# Altium project 家庭版电针仪.PrjPCB
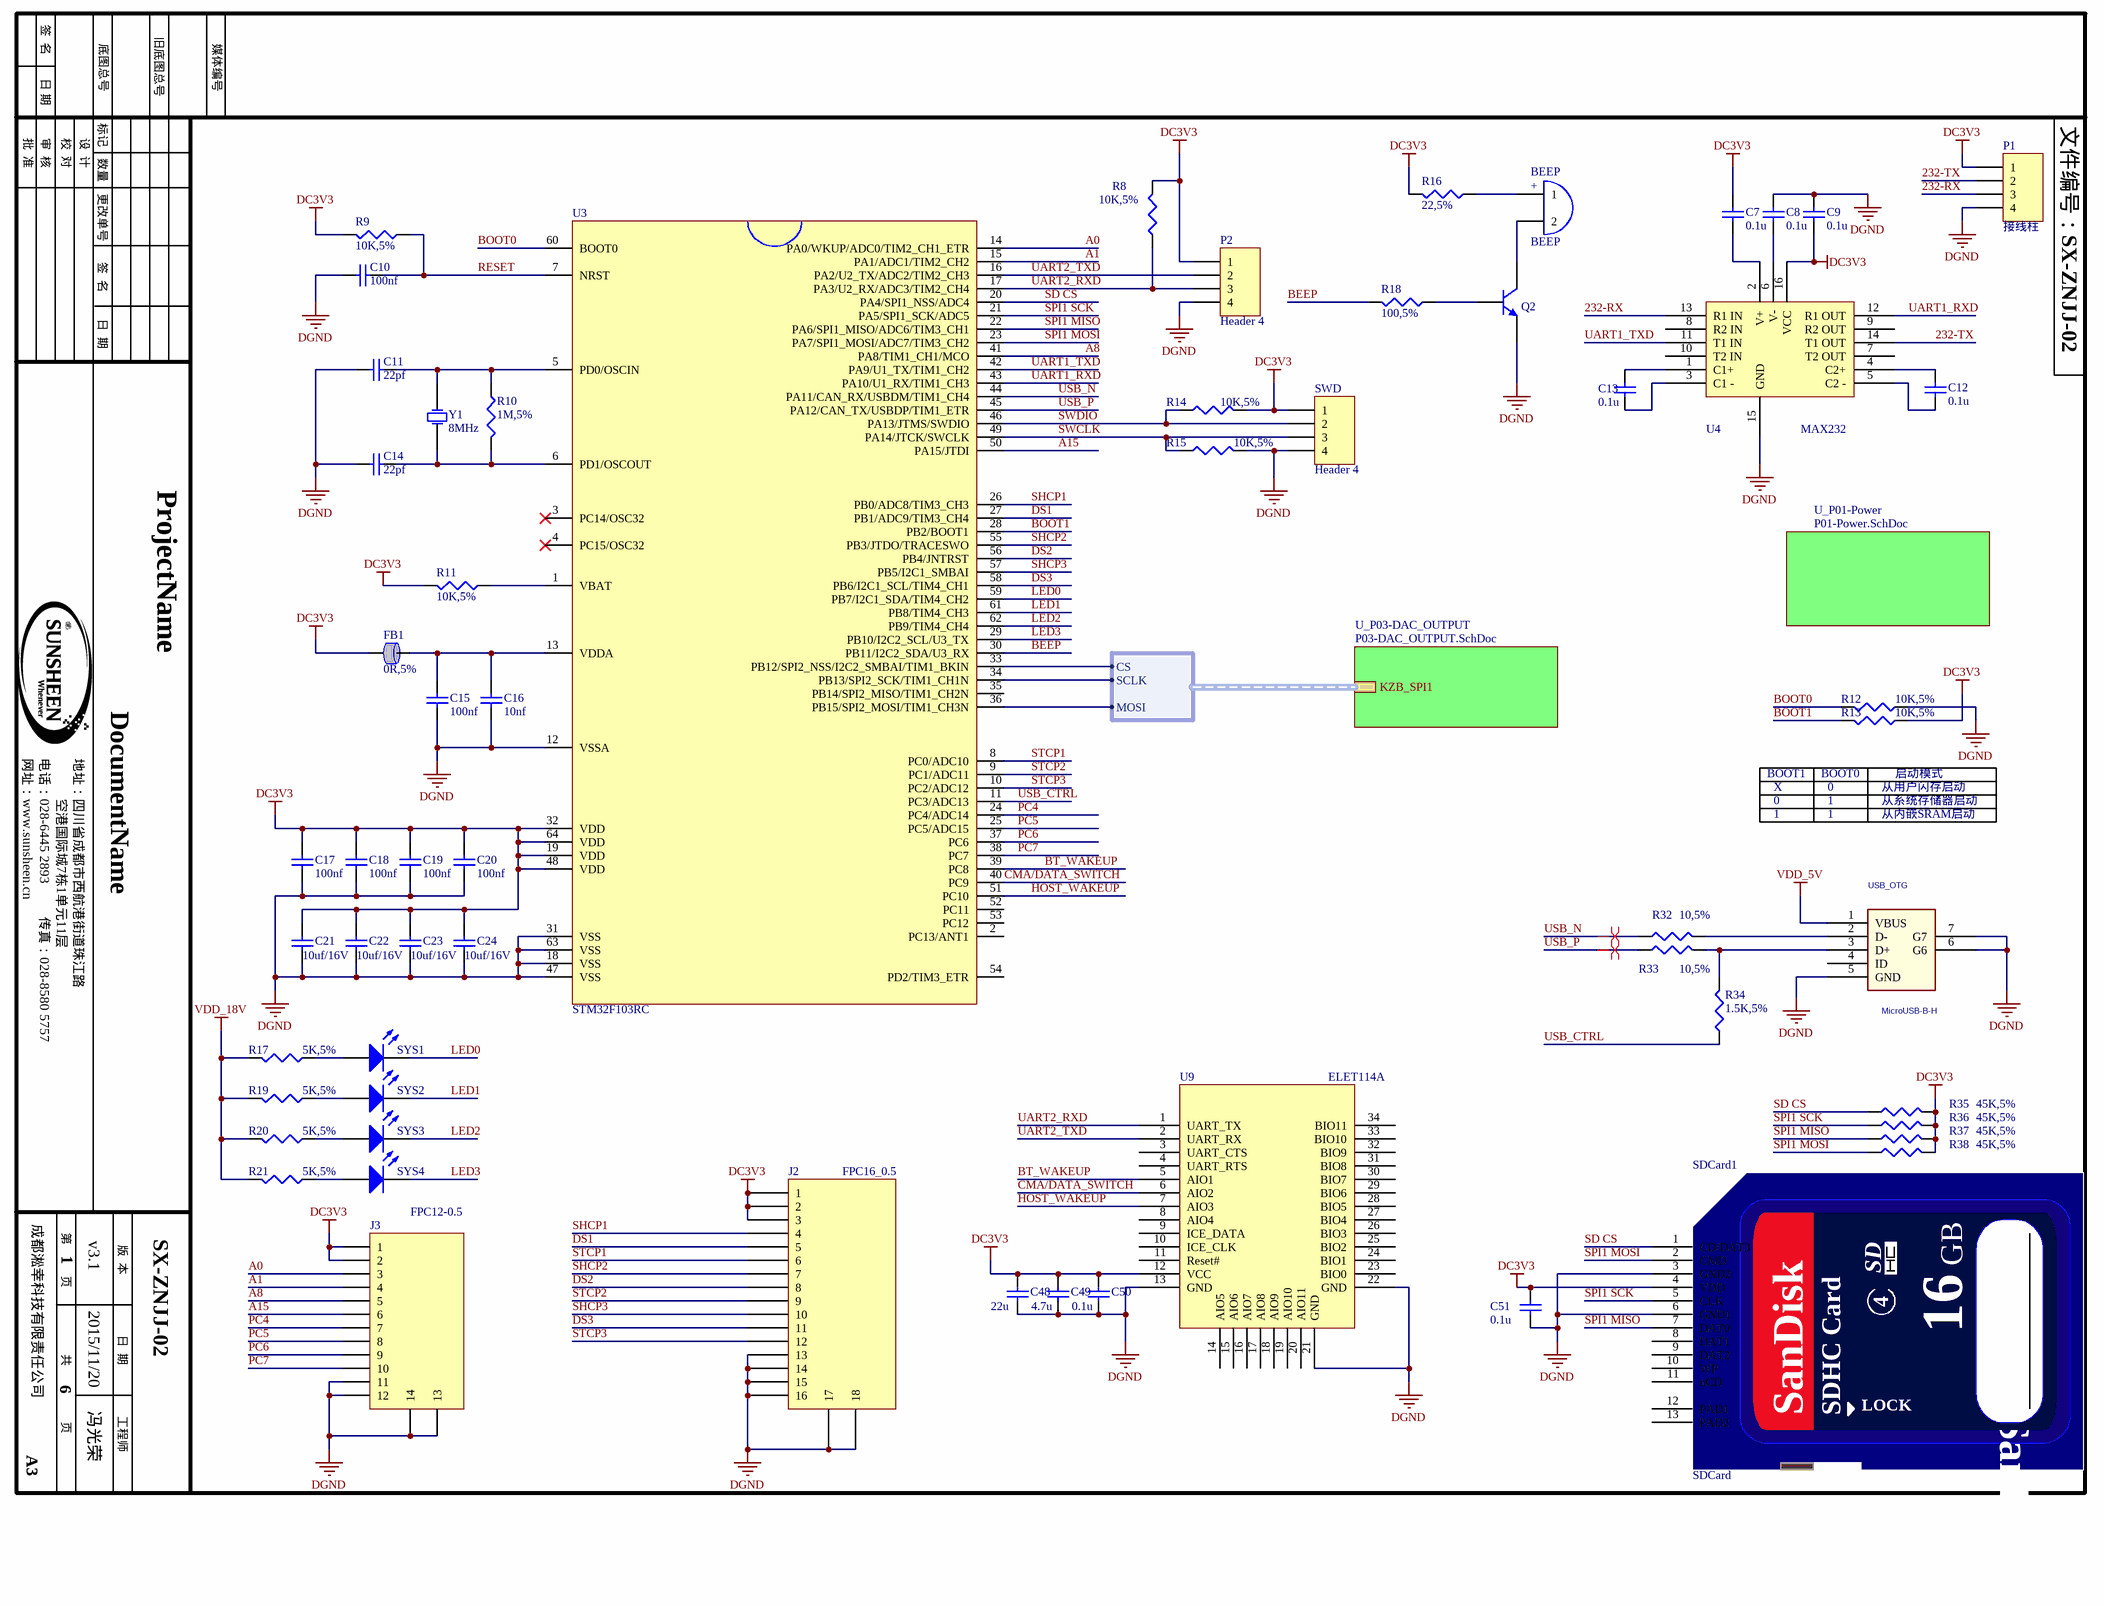
[diagram p0: MCU.SchDoc]
4 sheets, 197 parts. Net scope: hierarchical (ports join the sheet entries above them; power ports are global).
Board file: 家庭版电针仪.PcbDoc
Sheets:
  MCU.SchDoc
    U_P03-DAC_OUTPUT = P03-DAC_OUTPUT.SchDoc
      DAC1 = DAC_OUT.SchDoc
      DAC2 = DAC_OUT.SchDoc
      DAC3 = DAC_OUT.SchDoc
      DAC4 = DAC_OUT.SchDoc
    U_P01-Power = P01-Power.SchDoc

## Sheet MCU.SchDoc
size A3; Date: 2015/11/20; CompanyName: 成都淞幸科技有限责任公司; DrawnBy: 冯光荣; Engineer: 冯光荣; Organization: 系统集成部; Address1: 四川省成都市西航港街道珠江路; Address2: 空港国际城7栋1单元11层; DocumentNumber: SX-ZNJJ-02; Revision: v3.1; SheetNumber: 1; SheetTotal: 6; Telphone: 028-6445 2893; Fax: 028-8580 5757; Website: www.sunsheen.cn; DocumentName: DocumentName; ProjectName: ProjectName

### Parts
BEEP  BEEP  [蜂鸣器]
C7  0.1u  [Cap0603]
C8  0.1u  [Cap0603]
C9  0.1u  [Cap0603]
C10  100nf  [Cap0603]
C11  22pf  [Cap0603]
C12  0.1u  [Cap0603]
C13  0.1u  [Cap0603]
C14  22pf  [Cap0603]
C15  100nf  [Cap0603]
C16  10nf  [Cap0603]
C17  100nf  [Cap0603]
C18  100nf  [Cap0603]
C19  100nf  [Cap0603]
C20  100nf  [Cap0603]
C21  10uf/16V  [Cap0603]
C22  10uf/16V  [Cap0603]
C23  10uf/16V  [Cap0603]
C24  10uf/16V  [Cap0603]
C48  22u  [Cap0603]
C49  4.7u  [Cap0603]
C50  0.1u  [Cap0603]
C51  0.1u  [Cap0603]
FB1  0R,5%  [FB0603]
J2  FPC16_0.5  [FPC0.5-16P]
J3  FPC12-0.5  [FPC0.5-12P]
P1  接线柱  [4P接线柱5.08mm]
P2  Header 4  [HDR1X4]
Q2  S8050  [SOT-23B]  (value not drawn)
R8  10K,5%  [Res0603]
R9  10K,5%  [Res0603]
R10  1M,5%  [Res0603]
R11  10K,5%  [Res0603]
R12  10K,5%  [Res0603]
R13  10K,5%  [Res0603]
R14  10K,5%  [Res0603]
R15  10K,5%  [Res0603]
R16  22,5%  [Res0603]
R17  5K,5%  [Res0603]
R18  100,5%  [Res0603]
R19  5K,5%  [Res0603]
R20  5K,5%  [Res0603]
R21  5K,5%  [Res0603]
R32  10,5%  [Res0603]
R33  10,5%  [Res0603]
R34  1.5K,5%  [Res0603]
R35  45K,5%  [Res0603]
R36  45K,5%  [Res0603]
R37  45K,5%  [Res0603]
R38  45K,5%  [Res0603]
SDCard1  SDCard  [SDCard]
SWD  Header 4  [HDR1X4]
SYS1  RED  [坐式LED]  (value not drawn)
SYS2  RED  [坐式LED]  (value not drawn)
SYS3  RED  [坐式LED]  (value not drawn)
SYS4  RED  [坐式LED]  (value not drawn)
U3  STM32F103RC  [QFP50P1200X1200X160-64N]
U4  MAX232  [SO-16]
U9  ELET114A  [ELET114A]
USB_OTG  MicroUSB-B-H  [MICROUSB-B-H]
Y1  8MHz  [XTAL_49SMD]

### Sub-sheets
U_P01-Power = P01-Power.SchDoc: no entries
U_P03-DAC_OUTPUT = P03-DAC_OUTPUT.SchDoc: KZB_SPI1 (harness KZB_SPI1)

### Harnesses
KZB_SPI1: CS, SCLK, MOSI

### Nets
DC3V3: C7.2 C9.1 C17.2 C18.2 C19.2 C20.2 C21.2 C22.2 C23.2 C24.2 C48.2 C49.2 C50.2 C51.1 FB1.1 J2.1 J2.2 J2.3 J3.1 J3.2 P1.1 P2.1 R8.2 R9.2 R11.2 R13.1 R14.2 R16.2 R35.2 R36.2 R37.2 R38.2 SDCard1.4(VDD) SWD.1 U3.19(VDD) U3.32(VDD) U3.48(VDD) U3.64(VDD) U4.16(VCC) U9.12(VCC)
DGND: C8.2 C9.2 C10.1 C11.1 C14.1 C15.1 C16.1 C17.1 C18.1 C19.1 C20.1 C21.1 C22.1 C23.1 C24.1 C48.1 C49.1 C50.1 C51.2 J2.13 J2.14 J2.15 J2.16 J2.17 J2.18 J3.11 J3.12 J3.13 J3.14 P1.4 P2.4 Q2.2(E) R12.1 R15.2 SDCard1.3(GND2) SDCard1.6(GND1) SWD.4 U3.12(VSSA) U3.18(VSS) U3.31(VSS) U3.47(VSS) U3.63(VSS) U4.15(GND) U9.13(GND) U9.21(GND) U9.22(GND) USB_OTG.5(GND) USB_OTG.6(G6) USB_OTG.7(G7)
VDD_5V: USB_OTG.1(VBUS)
VDD_18V: R17.1 R19.1 R20.1 R21.1
232-RX: P1.3 U4.13(R1_IN)
232-TX: P1.2 U4.14(T1_OUT)
A0: J3.3 U3.14(PA0/WKUP/ADC0/TIM2_CH1_ETR)
A1: J3.4 U3.15(PA1/ADC1/TIM2_CH2)
A8: J3.5 U3.41(PA8/TIM1_CH1/MCO)
A15: J3.6 U3.50(PA15/JTDI)
BEEP: R18.2 U3.30(PB11/I2C2_SDA/U3_RX)
BOOT0: R12.2 U3.60(BOOT0)
BOOT1: R13.2 U3.28(PB2/BOOT1)
BT_WAKEUP: U3.39(PC8) U9.5(AIO1)
CMA/DATA_SWITCH: U3.40(PC9) U9.6(AIO2)
DS1: J2.5 U3.27(PB1/ADC9/TIM3_CH4)
DS2: J2.8 U3.56(PB4/JNTRST)
DS3: J2.11 U3.58(PB6/I2C1_SCL/TIM4_CH1)
HOST_WAKEUP: U3.51(PC10) U9.7(AIO3)
LED0: SYS1.K U3.59(PB7/I2C1_SDA/TIM4_CH2)
LED1: SYS2.K U3.61(PB8/TIM4_CH3)
LED2: SYS3.K U3.62(PB9/TIM4_CH4)
LED3: SYS4.K U3.29(PB10/I2C2_SCL/U3_TX)
PC4: J3.7 U3.24(PC4/ADC14)
PC5: J3.8 U3.25(PC5/ADC15)
PC6: J3.9 U3.37(PC6)
PC7: J3.10 U3.38(PC7)
RESET: C10.2 R9.1 U3.7(NRST)
SD CS: R35.1 SDCard1.1(CD/DAT3) U3.20(PA4/SPI1_NSS/ADC4)
SHCP1: J2.4 U3.26(PB0/ADC8/TIM3_CH3)
SHCP2: J2.7 U3.55(PB3/JTDO/TRACESWO)
SHCP3: J2.10 U3.57(PB5/I2C1_SMBAI)
SPI1 MISO: R37.1 SDCard1.7(DAT0) U3.22(PA6/SPI1_MISO/ADC6/TIM3_CH1)
SPI1 MOSI: R38.1 SDCard1.2(CMD) U3.23(PA7/SPI1_MOSI/ADC7/TIM3_CH2)
SPI1 SCK: R36.1 SDCard1.5(CLK) U3.21(PA5/SPI1_SCK/ADC5)
STCP1: J2.6 U3.8(PC0/ADC10)
STCP2: J2.9 U3.9(PC1/ADC11)
STCP3: J2.12 U3.10(PC2/ADC12)
SWCLK: R15.1 SWD.3 U3.49(PA14/JTCK/SWCLK)
SWDIO: R14.1 SWD.2 U3.46(PA13/JTMS/SWDIO)
UART1_RXD: U3.43(PA10/U1_RX/TIM1_CH3) U4.12(R1_OUT)
UART1_TXD: U3.42(PA9/U1_TX/TIM1_CH2) U4.11(T1_IN)
UART2_RXD: P2.3 R8.1 U3.17(PA3/U2_RX/ADC3/TIM2_CH4) U9.1(UART_TX)
UART2_TXD: P2.2 U3.16(PA2/U2_TX/ADC2/TIM2_CH3) U9.2(UART_RX)
USB_CTRL: R34.1 U3.11(PC3/ADC13)
USB_N: R32.1 U3.44(PA11/CAN_RX/USBDM/TIM1_CH4)
USB_P: R33.1 U3.45(PA12/CAN_TX/USBDP/TIM1_ETR)
NetBEEP_1: BEEP.1 R16.1
NetBEEP_2: BEEP.2 Q2.3(C)
NetC7_1: C7.1 U4.2(V+)
NetC8_1: C8.1 U4.6(V-)
NetC11_2: C11.2 R10.1 U3.5(PD0/OSCIN) Y1.1(OSC1)
NetC12_1: C12.1 U4.5(C2_-)
NetC12_2: C12.2 U4.4(C2+)
NetC13_1: C13.1 U4.3(C1_-)
NetC13_2: C13.2 U4.1(C1+)
NetC14_2: C14.2 R10.2 U3.6(PD1/OSCOUT) Y1.2(OSC2)
NetC15_2: C15.2 C16.2 FB1.2 U3.13(VDDA)
NetQ2_1: Q2.1(B) R18.1
NetR11_1: R11.1 U3.1(VBAT)
NetR17_2: R17.2 SYS1.A
NetR19_2: R19.2 SYS2.A
NetR20_2: R20.2 SYS3.A
NetR21_2: R21.2 SYS4.A
NetR32_2: R32.2 USB_OTG.2(D-)
NetR33_2: R33.2 R34.2 USB_OTG.3(D+)
NetU3_33: U3.33(PB12/SPI2_NSS/I2C2_SMBAI/TIM1_BKIN) ; sheet U_P03-DAC_OUTPUT/KZB_SPI1.CS
NetU3_34: U3.34(PB13/SPI2_SCK/TIM1_CH1N) ; sheet U_P03-DAC_OUTPUT/KZB_SPI1.SCLK
NetU3_36: U3.36(PB15/SPI2_MOSI/TIM1_CH3N) ; sheet U_P03-DAC_OUTPUT/KZB_SPI1.MOSI

Not connected (* = marked no-connect by the designer): SDCard1 8(DAT1) 9(DAT2) 10(WP) 11(nCD) 12(PAD1) 13(PAD2); U3 2(PC13/ANT1) 3(PC14/OSC32)* 4(PC15/OSC32)* 35(PB14/SPI2_MISO/TIM1_CH2N) 52(PC11) 53(PC12) 54(PD2/TIM3_ETR); U4 7(T2_OUT) 8(R2_IN) 9(R2_OUT) 10(T2_IN); U9 3(UART_CTS) 4(UART_RTS) 8(AIO4) 9(ICE_DATA) 10(ICE_CLK) 11(Reset#) 14(AIO5) 15(AIO6) 16(AIO7) 17(AIO8) 18(AIO9) 19(AIO10) 20(AIO11) 23(BIO0) 24(BIO1) 25(BIO2) 26(BIO3) 27(BIO4) 28(BIO5) 29(BIO6) 30(BIO7) 31(BIO8) 32(BIO9) 33(BIO10) 34(BIO11); USB_OTG 4(ID)

### Layout directives
differential pair: USB_N, USB_P

### Notes on the sheet
- BOOT1
- BOOT0
- 启动模式
- X
- 0
- 1
- 从用户闪存启动
- 从系统存储器启动
- 从内嵌SRAM启动
- 签  名
- 底图总号
- 旧底图总号
- 媒体编号
- 日 期
- 批  准
- 审  核
- 校  对
- 设  计
- 标记
- 数量
- 文件编号：
- 更改单号
- 日  期
- 网址：
- 电话：
- 地址：
- 传真：
- 第
- 版  本
- 页
- 共
- A3
- 工程师
- (in symbol BELL) +
- (in symbol SDCard) GB; SD; 16; SanDisk; SDHC Card; LOCK

### Library data of the parts
BEEP = BELL
C7-C24 C48-C51 = Cap Semi: 无极性电容（表贴）
FB1 = FerriteBead: 磁珠
P1 P2 SWD = Header 4: Header, 4-Pin
  SWD: LatestRevisionDate: 17-Jul-2002; LatestRevisionNote: Re-released for DXP Platform.; Publisher: Altium Limited
Q2 = S8050: NPN
R8-R21 R32-R38 = Res: 电阻
SDCard1 = SDCard: SDCard插座
SYS1-SYS4 = LED: Typical RED, GREEN, YELLOW, AMBER GaAs LED
U4 = MAX232AEWE(16): +-15KV ESD-PROTECTED, +5V RS-232 TRANSCEIVERS
USB_OTG = MicroUSB-B-H: 手机接口型USB
Y1 = XTAL: 晶体振荡器

## Sheet P03-DAC_OUTPUT.SchDoc
size A3; Date: 2015/11/20; CompanyName: 成都淞幸科技有限责任公司; DrawnBy: 冯光荣; Engineer: 冯光荣; Organization: 系统集成部; Address1: 四川省成都市西航港街道珠江路; Address2: 空港国际城7栋1单元11层; DocumentNumber: SX-ZNJJ-02; Revision: v3.1; SheetNumber: 4; SheetTotal: 6; Telphone: 028-6445 2893; Fax: 028-8580 5757; Website: www.sunsheen.cn; DocumentName: DocumentName; ProjectName: ProjectName
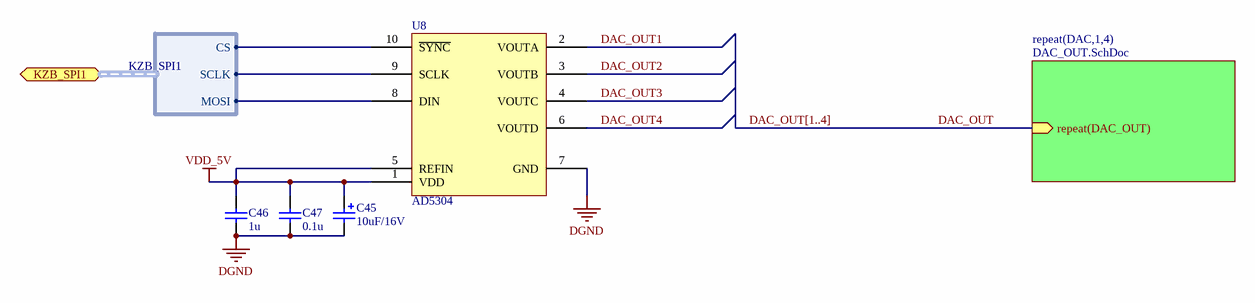
[diagram p1: P03-DAC_OUTPUT.SchDoc]

### Parts
C45  10uF/16V  [CAPPLO3_A_3216-18]
C46  1u  [Cap0603]
C47  0.1u  [Cap0603]
U8  AD5304  [MSOP10]

### Sub-sheets
repeat(DAC,1,4) = DAC_OUT.SchDoc: repeat(DAC_OUT) (in)

### Ports
KZB_SPI1 (harness KZB_SPI1)

### Harnesses
KZB_SPI1: CS, SCLK, MOSI

### Nets
DGND: C45.2 C46.1 C47.1 U8.7(GND)
VDD_5V: C45.1 C46.2 C47.2 U8.1(VDD) U8.5(REFIN)
DAC_OUT: sheet repeat(DAC,1,4)/repeat(DAC_OUT)
DAC_OUT1: U8.2(VOUTA)
DAC_OUT2: U8.3(VOUTB)
DAC_OUT3: U8.4(VOUTC)
DAC_OUT4: U8.6(VOUTD)
NetU3_33: U8.10(~{SYNC}) ; port KZB_SPI1.CS
NetU3_34: U8.9(SCLK) ; port KZB_SPI1.SCLK
NetU3_36: U8.8(DIN) ; port KZB_SPI1.MOSI

### Buses and harness runs
bus DAC_OUT[1..4]

### Notes on the sheet
- 签  名
- 底图总号
- 旧底图总号
- 媒体编号
- 日 期
- 批  准
- 审  核
- 校  对
- 设  计
- 标记
- 数量
- 文件编号：
- 更改单号
- 日  期
- 网址：
- 电话：
- 地址：
- 传真：
- 第
- 版  本
- 页
- 共
- A3
- 工程师

### Library data of the parts
C45 = Cap Pol3: 极性电容（表贴）
C46 C47 = Cap Semi: 无极性电容（表贴）

## Sheet DAC_OUT.SchDoc
size A3; Date: 2015/11/20; CompanyName: 成都淞幸科技有限责任公司; DrawnBy: 冯光荣; Engineer: 冯光荣; Organization: 系统集成部; Address1: 四川省成都市西航港街道珠江路; Address2: 空港国际城7栋1单元11层; DocumentNumber: SX-ZNJJ-02; Revision: v3.1; SheetNumber: 6; SheetTotal: 6; Telphone: 028-6445 2893; Fax: 028-8580 5757; Website: www.sunsheen.cn; DocumentName: DocumentName; ProjectName: ProjectName
Used 4 times, as channels U_P03-DAC_OUTPUT/DAC1, U_P03-DAC_OUTPUT/DAC2, U_P03-DAC_OUTPUT/DAC3, U_P03-DAC_OUTPUT/DAC4. Parts and nets are listed once, with the designators drawn on the sheet.
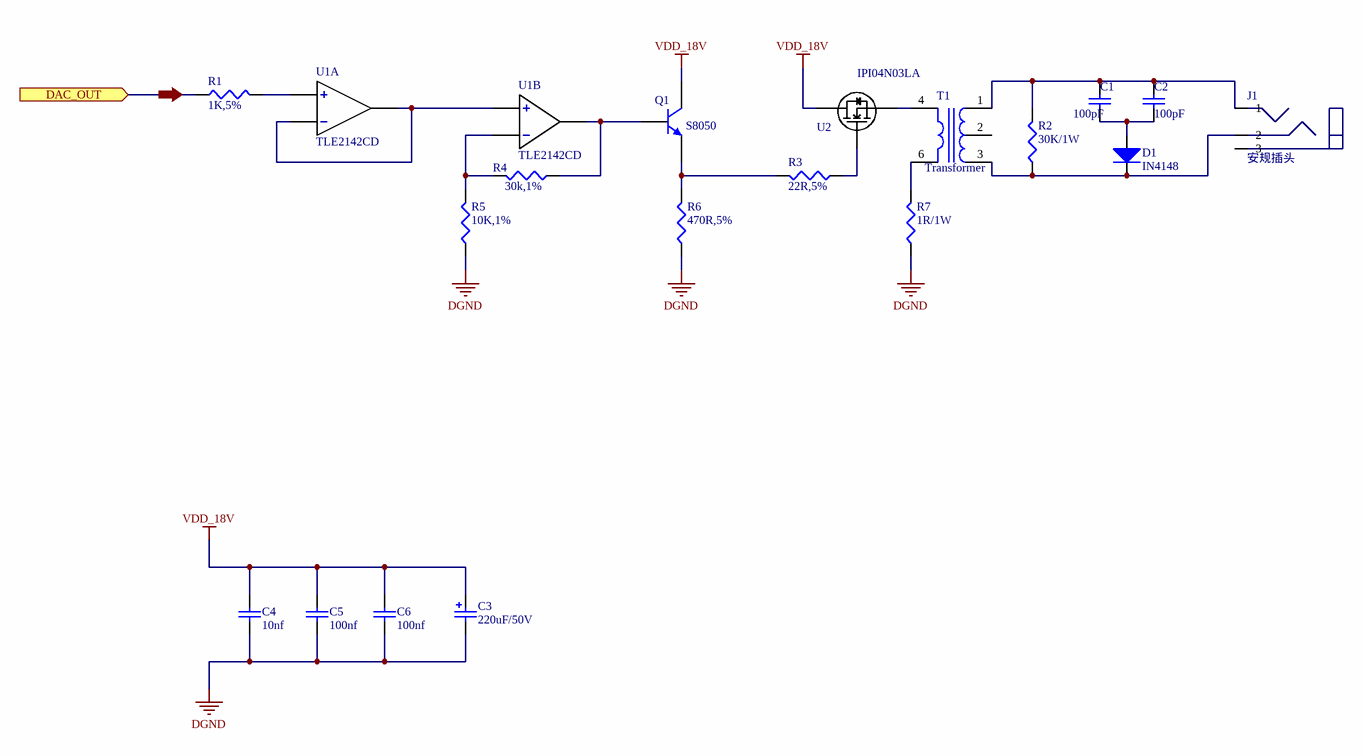
[diagram p2: DAC_OUT.SchDoc]

### Parts
C1  100pF  [Cap0603]
C2  100pF  [Cap0603]
C3  220uF/50V  [CapPol1_D12]
C4  10nf  [Cap0603]
C5  100nf  [Cap0603]
C6  100nf  [Cap0603]
D1  IN4148  [DIOMELF2513N]
J1  安规插头  [安规插头]
Q1  S8050  [SOT-23B]
R1  1K,5%  [Res0603]
R2  30K/1W  [Res_Power_5.0_4.0]
R3  22R,5%  [Res0603]
R4  30k,1%  [Res0603]
R5  10K,1%  [Res0603]
R6  470R,5%  [Res0603]
R7  1R/1W  [Res_Power_5.0_4.0]
T1  Transformer  [Transformer_19_19]
U1  TLE2142CD  [SOIC127P600X175-8N]  (parts A,B of 2)
U2  IPI04N03LA  [TO228P1003X238-3N]

### Ports
DAC_OUT (in)

### Nets
DGND: C3.2 C4.1 C5.1 C6.1 R5.1 R6.1 R7.1 U1.4(VCC-)
VDD_18V: C3.1 C4.2 C5.2 C6.2 Q1.3(C) U1.8(VCC+) U2.2(D)
DAC_OUT: R1.1 ; port DAC_OUT
NetC1_1: C1.1 C2.1 D1.A
NetC1_2: C1.2 C2.2 J1.1 R2.2 T1.1
NetD1_C: D1.C J1.2 R2.1 T1.3
NetQ1_1: Q1.1(B) R4.1 U1.7(OUT2)
NetQ1_2: Q1.2(E) R3.2 R6.2
NetR1_2: R1.2 U1.3(IN1+)
NetR3_1: R3.1 U2.1(G)
NetR4_2: R4.2 R5.2 U1.6(IN2-)
NetR7_2: R7.2 T1.6
NetT1_4: T1.4 U2.3(S)
NetU1_1: U1.1(OUT1) U1.2(IN1-) U1.5(IN2+)

Not connected (* = marked no-connect by the designer): J1 3; T1 2

### Channels
U_P03-DAC_OUTPUT/DAC1: designators end in A; ports DAC_OUT=DAC_OUT1
U_P03-DAC_OUTPUT/DAC2: designators end in B; ports DAC_OUT=DAC_OUT2
U_P03-DAC_OUTPUT/DAC3: designators end in C; ports DAC_OUT=DAC_OUT3
U_P03-DAC_OUTPUT/DAC4: designators end in D; ports DAC_OUT=DAC_OUT4

### Notes on the sheet
- 签  名
- 底图总号
- 旧底图总号
- 媒体编号
- 日 期
- 批  准
- 审  核
- 校  对
- 设  计
- 标记
- 数量
- 文件编号：
- 更改单号
- 日  期
- 网址：
- 电话：
- 地址：
- 传真：
- 第
- 版  本
- 页
- 共
- A3
- 工程师

### Library data of the parts
C1 C2 C4-C6 = Cap Semi: 无极性电容（表贴）
C3 = Cap Pol1: 极性电容（径向）
D1 = Dio_IN4148
Q1 = S8050: NPN
R1 R3-R6 = Res: 电阻
R2 R7 = Res: 功率电阻
T1 = Transformer: 变压器
U1 = TLE2142CD: 运放
U2 = IPI04N03LA: N沟道MOS管

## Sheet P01-Power.SchDoc
size A3; Date: 2015/11/20; CompanyName: 成都淞幸科技有限责任公司; DrawnBy: 冯光荣; Engineer: 冯光荣; Organization: 系统集成部; Address1: 四川省成都市西航港街道珠江路; Address2: 空港国际城7栋1单元11层; DocumentNumber: SX-ZNJJ-02; Revision: v3.1; SheetNumber: 2; SheetTotal: 6; Telphone: 028-6445 2893; Fax: 028-8580 5757; Website: www.sunsheen.cn; DocumentName: DocumentName; ProjectName: ProjectName
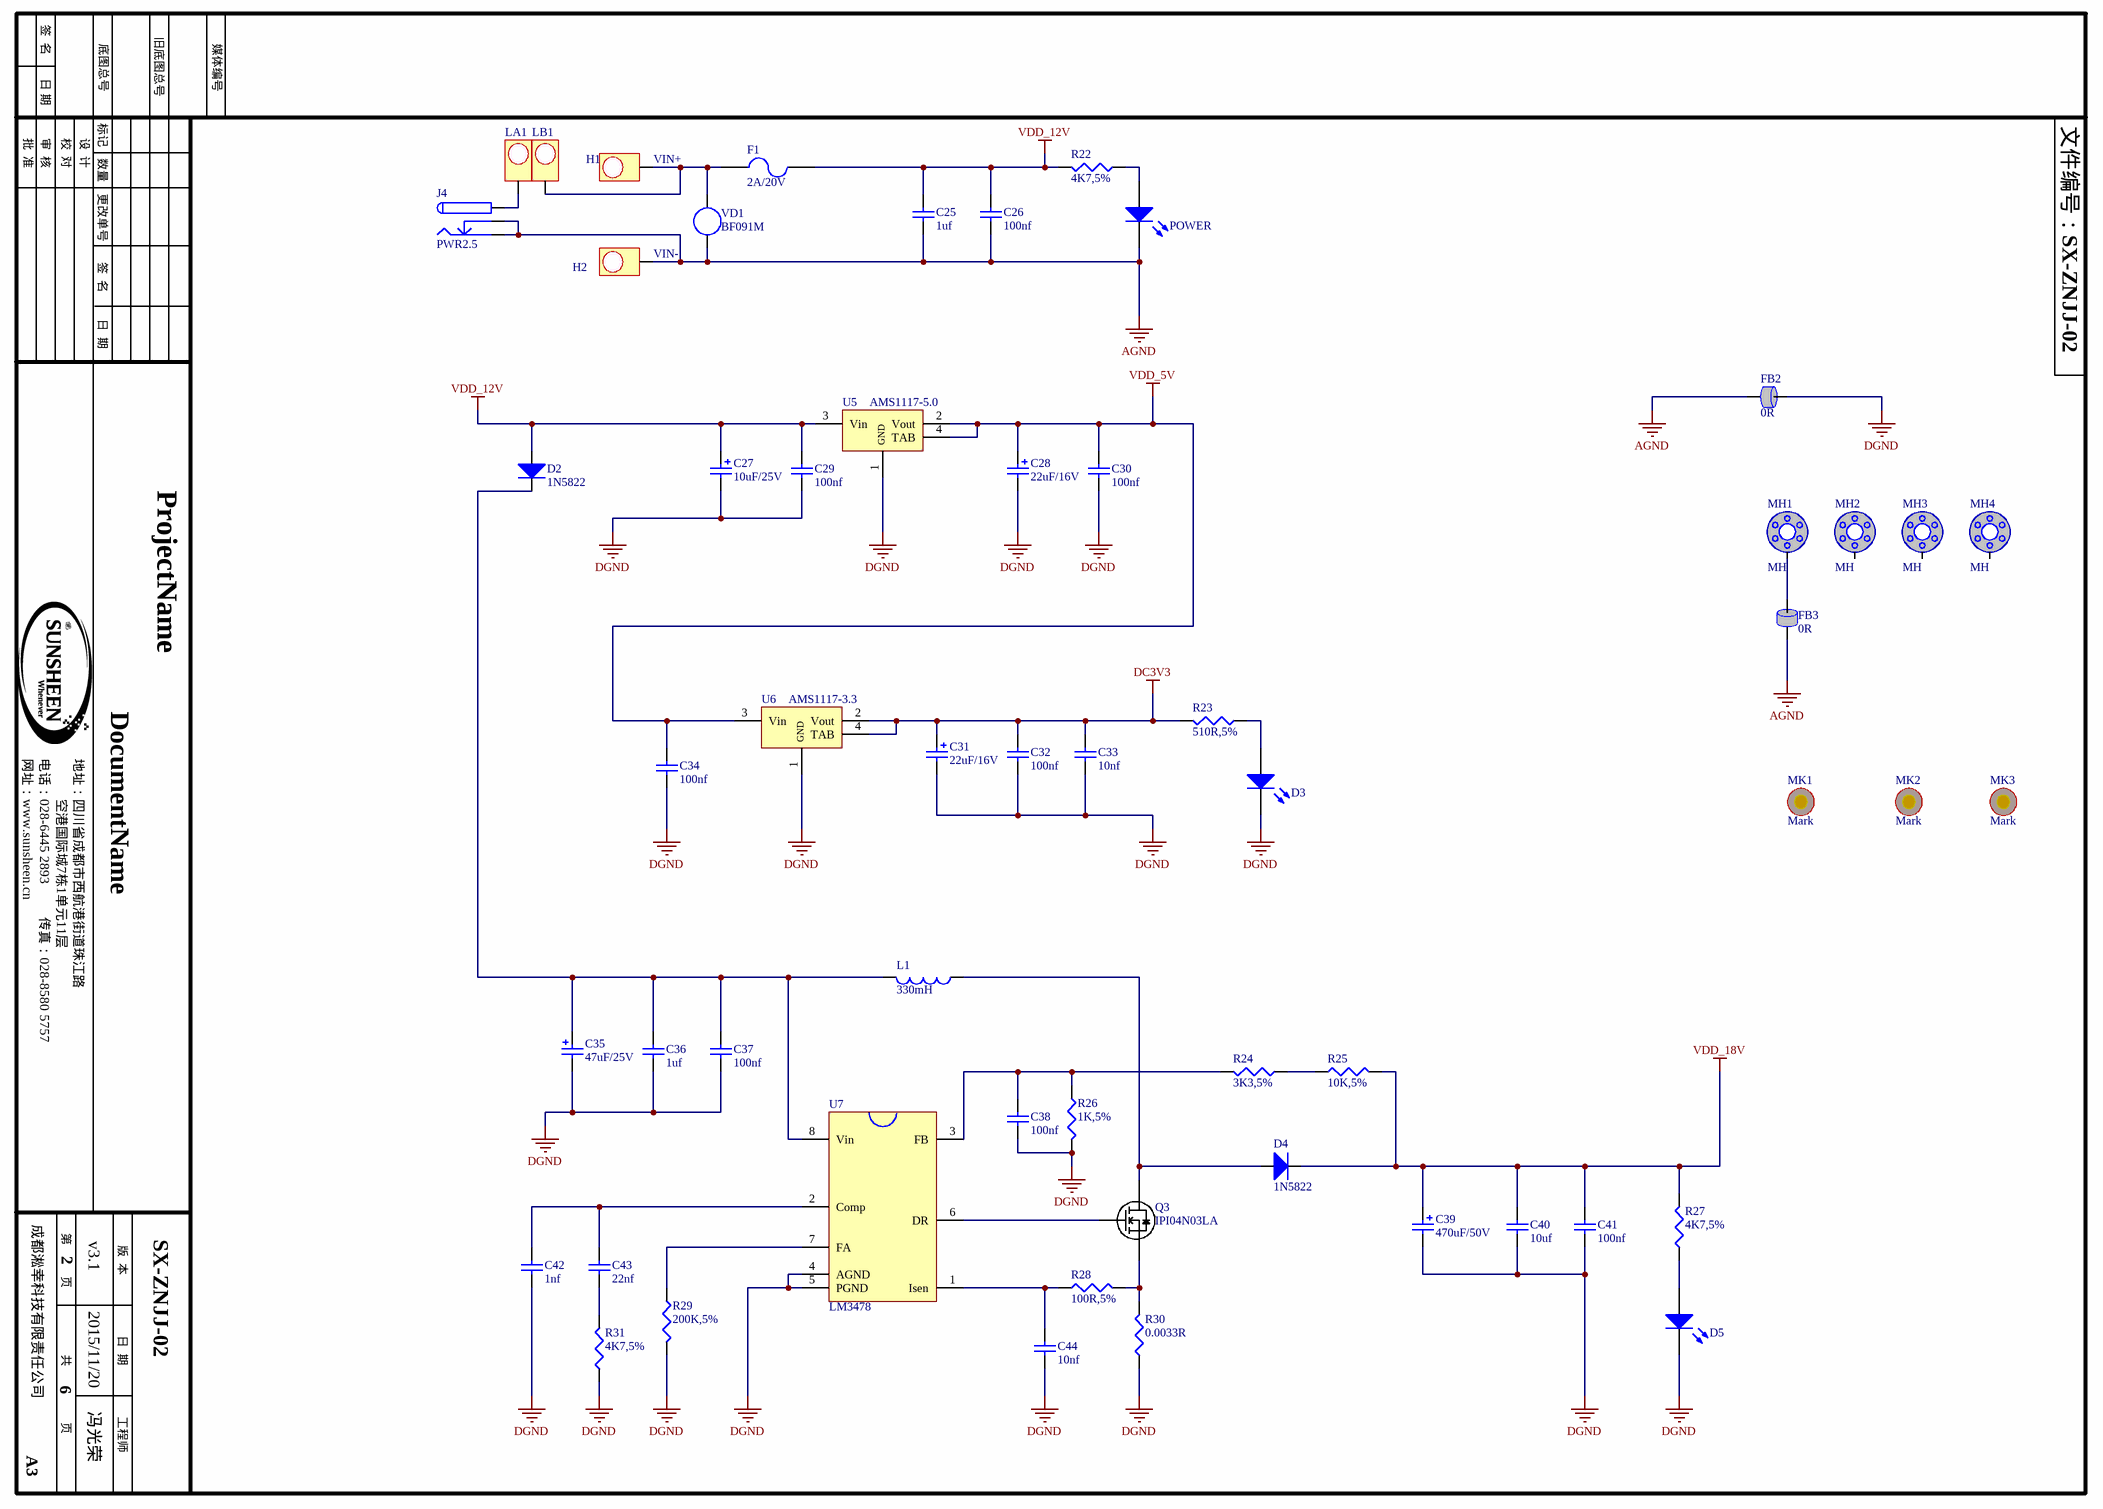
[diagram p3: P01-Power.SchDoc]

### Parts
C25  1uf  [Cap0603]
C26  100nf  [Cap0603]
C27  10uF/25V  [CapPol1_D5]
C28  22uF/16V  [CapPol1_D5]
C29  100nf  [Cap0603]
C30  100nf  [Cap0603]
C31  22uF/16V  [CapPol1_D5]
C32  100nf  [Cap0603]
C33  10nf  [Cap0603]
C34  100nf  [Cap0603]
C35  47uF/25V  [CapPol1_D6]
C36  1uf  [Cap0603]
C37  100nf  [Cap0603]
C38  100nf  [Cap0603]
C39  470uF/50V  [CapPol1_D10]
C40  10uf  [Cap0603]
C41  100nf  [Cap0603]
C42  1nf  [Cap0603]
C43  22nf  [Cap0603]
C44  10nf  [Cap0603]
D2  1N5822  [1N5822]
D3  RED  [LED0603]  (value not drawn)
D4  1N5822  [1N5822]
D5  RED  [LED0603]  (value not drawn)
F1  2A/20V  [1812]
FB2  0R  [FB0603]
FB3  0R  [FB0603]
H1  VIN+  [HOLE_POWER]
H2  VIN-  [HOLE_POWER]
J4  PWR2.5  [KLD-0202]
L1  330mH  [Inductor_12x12x7]
LA1  HOLE_POWER  [HOLE_POWER]  (value not drawn)
LB1  HOLE_POWER  [HOLE_POWER]  (value not drawn)
MH1  MH  [AS_D3mm-6mm]
MH2  MH  [AS_D3mm-6mm]
MH3  MH  [AS_D3mm-6mm]
MH4  MH  [AS_D3mm-6mm]
MK1  Mark  [MK]
MK2  Mark  [MK]
MK3  Mark  [MK]
POWER  RED  [LED0603]  (value not drawn)
Q3  IPI04N03LA  [TO228]
R22  4K7,5%  [Res0603]
R23  510R,5%  [Res0603]
R24  3K3,5%  [Res0603]
R25  10K,5%  [Res0603]
R26  1K,5%  [Res0603]
R27  4K7,5%  [Res0603]
R28  100R,5%  [Res0603]
R29  200K,5%  [Res0603]
R30  0.0033R  [1206A]
R31  4K7,5%  [Res0603]
U5  AMS1117-5.0  [AMS1117]
U6  AMS1117-3.3  [AMS1117]
U7  LM3478  [SOP65P490X110-8N]
VD1  BF091M  [B3D230L]

### Nets
AGND: C25.1 C26.1 FB2.1 FB3.1 H2.1 J4.2 J4.3 POWER.K VD1.2
DC3V3: C31.1 C32.2 C33.2 R23.2 U6.2(Vout) U6.4(TAB)
DGND: C27.2 C28.2 C29.1 C30.1 C31.2 C32.1 C33.1 C34.1 C35.2 C36.1 C37.1 C38.1 C39.2 C40.1 C41.1 C42.1 C44.1 D3.K D5.K FB2.2 R26.2 R29.1 R30.1 R31.1 U5.1(GND) U6.1(GND) U7.4(AGND) U7.5(PGND)
VDD_5V: C28.1 C30.2 C34.2 U5.2(Vout) U5.4(TAB) U6.3(Vin)
VDD_12V: C25.2 C26.2 C27.1 C29.2 D2.A F1.2 R22.2 U5.3(Vin)
VDD_18V: C39.1 C40.2 C41.2 D4.C R25.2 R27.2
NetC35_1: C35.1 C36.2 C37.2 D2.C L1.1 U7.8(Vin)
NetC38_2: C38.2 R24.2 R26.1 U7.3(FB)
NetC42_2: C42.2 C43.2 U7.2(Comp)
NetC43_1: C43.1 R31.2
NetC44_2: C44.2 R28.1 U7.1(Isen)
NetD3_A: D3.A R23.1
NetD4_A: D4.A L1.2 Q3.2(D)
NetD5_A: D5.A R27.1
NetF1_1: F1.1 H1.1 LB1.1 VD1.1
NetFB3_2: FB3.2 MH1.MH1
NetJ4_4: J4.4 LA1.1
NetPOWER_A: POWER.A R22.1
NetQ3_1: Q3.1(G) U7.6(DR)
NetQ3_3: Q3.3(S) R28.2 R30.2
NetR24_1: R24.1 R25.1
NetR29_2: R29.2 U7.7(FA)

Not connected (* = marked no-connect by the designer): MH2 MH1; MH3 MH1; MH4 MH1

### Notes on the sheet
- 签  名
- 底图总号
- 旧底图总号
- 媒体编号
- 日 期
- 批  准
- 审  核
- 校  对
- 设  计
- 标记
- 数量
- 文件编号：
- 更改单号
- 日  期
- 网址：
- 电话：
- 地址：
- 传真：
- 第
- 版  本
- 页
- 共
- A3
- 工程师

### Library data of the parts
C25 C26 C29 C30 C32-C34 C36-C38 C40-C44 = Cap Semi: 无极性电容（表贴）
C27 C28 C31 C35 C39 = Cap Pol1: 极性电容（径向）
D2 D4 = DIODE: 肖基特二极管
D3 D5 POWER = LED: as SYS1 on sheet MCU
F1 = Fuse: 保险丝
FB2 FB3 = FerriteBead: 磁珠
H1 H2 LA1 LB1 = HOLE_POWER: 电源接线孔
J4 = PWR2.5: 低电压电源连接器
L1 = Inductor: 电感
MH1-MH4 = MH: 固定孔
MK1-MK3 = Mark: 贴片马克点
Q3 = IPI04N03LA: N沟道MOS管
R22-R31 = Res: 电阻
U5 U6 = AMS1117-3.3: 稳压器
VD1 = B3D230L

## Nets that join several sheets
DC3V3: MCU (40 pins), P01-Power (6 pins)
DGND: MCU (49 pins), P03-DAC_OUTPUT (C45.2 C46.1 C47.1 U8.7), U_P03-DAC_OUTPUT/DAC1 (8 pins), U_P03-DAC_OUTPUT/DAC2 (8 pins), U_P03-DAC_OUTPUT/DAC3 (8 pins), U_P03-DAC_OUTPUT/DAC4 (8 pins), P01-Power (28 pins)
VDD_5V: MCU (USB_OTG.1), P03-DAC_OUTPUT (5 pins), P01-Power (6 pins)
VDD_18V: MCU (R17.1 R19.1 R20.1 R21.1), U_P03-DAC_OUTPUT/DAC1 (7 pins), U_P03-DAC_OUTPUT/DAC2 (7 pins), U_P03-DAC_OUTPUT/DAC3 (7 pins), U_P03-DAC_OUTPUT/DAC4 (7 pins), P01-Power (6 pins)
DAC_OUT1: P03-DAC_OUTPUT (U8.2), U_P03-DAC_OUTPUT/DAC1 (R1A.1)
DAC_OUT2: P03-DAC_OUTPUT (U8.3), U_P03-DAC_OUTPUT/DAC2 (R1B.1)
DAC_OUT3: P03-DAC_OUTPUT (U8.4), U_P03-DAC_OUTPUT/DAC3 (R1C.1)
DAC_OUT4: P03-DAC_OUTPUT (U8.6), U_P03-DAC_OUTPUT/DAC4 (R1D.1)
NetU3_33: MCU (U3.33), P03-DAC_OUTPUT (U8.10)
NetU3_34: MCU (U3.34), P03-DAC_OUTPUT (U8.9)
NetU3_36: MCU (U3.36), P03-DAC_OUTPUT (U8.8)